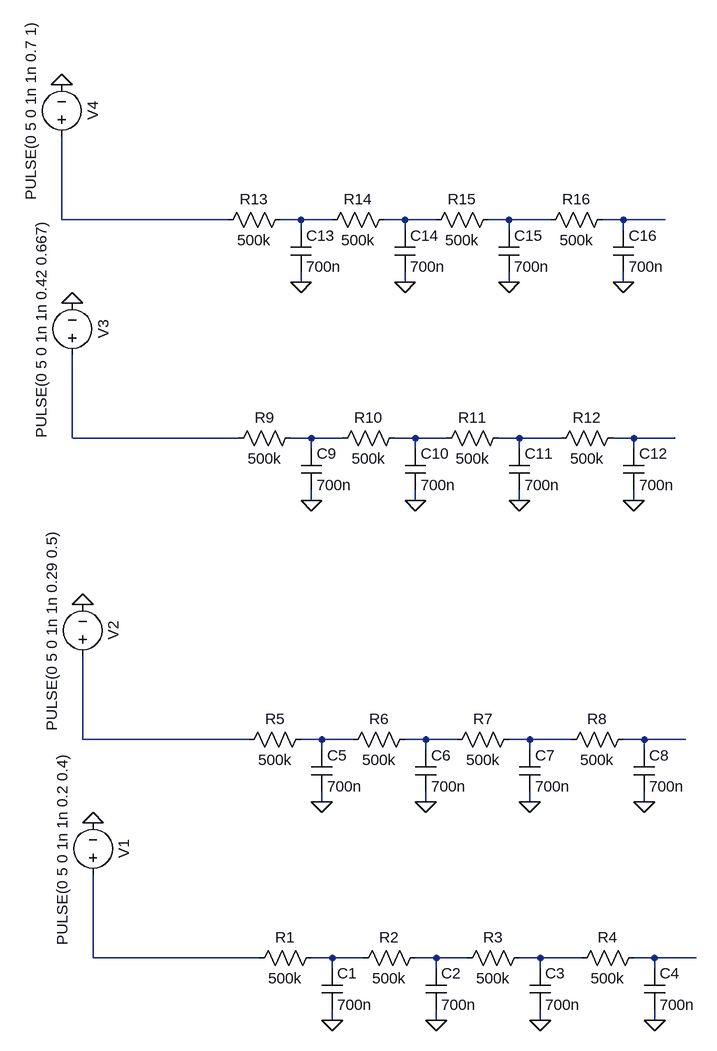
[diagram p0: schematic Draft3.asc]
Draft3.asc, the LTspice schematic file:
Version 4
SHEET 1 880 980
WIRE -416 -272 -416 -400
WIRE -160 -272 -416 -272
WIRE -48 -272 -80 -272
WIRE 0 -272 -48 -272
WIRE 112 -272 80 -272
WIRE 160 -272 112 -272
WIRE 272 -272 240 -272
WIRE 336 -272 272 -272
WIRE 448 -272 416 -272
WIRE 512 -272 448 -272
WIRE -48 -256 -48 -272
WIRE 112 -256 112 -272
WIRE 272 -256 272 -272
WIRE 448 -256 448 -272
WIRE -48 -176 -48 -192
WIRE 112 -176 112 -192
WIRE 272 -176 272 -192
WIRE 448 -176 448 -192
WIRE -400 64 -400 -64
WIRE -144 64 -400 64
WIRE -32 64 -64 64
WIRE 16 64 -32 64
WIRE 128 64 96 64
WIRE 176 64 128 64
WIRE 288 64 256 64
WIRE 352 64 288 64
WIRE 464 64 432 64
WIRE 528 64 464 64
WIRE -32 80 -32 64
WIRE 128 80 128 64
WIRE 288 80 288 64
WIRE 464 80 464 64
WIRE -32 160 -32 144
WIRE 128 160 128 144
WIRE 288 160 288 144
WIRE 464 160 464 144
WIRE -384 528 -384 400
WIRE -128 528 -384 528
WIRE -16 528 -48 528
WIRE 32 528 -16 528
WIRE 144 528 112 528
WIRE 192 528 144 528
WIRE 304 528 272 528
WIRE 368 528 304 528
WIRE 480 528 448 528
WIRE 544 528 480 528
WIRE -16 544 -16 528
WIRE 144 544 144 528
WIRE 304 544 304 528
WIRE 480 544 480 528
WIRE -16 624 -16 608
WIRE 144 624 144 608
WIRE 304 624 304 608
WIRE 480 624 480 608
WIRE -368 864 -368 736
WIRE -112 864 -368 864
WIRE 0 864 -32 864
WIRE 48 864 0 864
WIRE 160 864 128 864
WIRE 208 864 160 864
WIRE 320 864 288 864
WIRE 384 864 320 864
WIRE 496 864 464 864
WIRE 560 864 496 864
WIRE 0 880 0 864
WIRE 160 880 160 864
WIRE 320 880 320 864
WIRE 496 880 496 864
WIRE 0 960 0 944
WIRE 160 960 160 944
WIRE 320 960 320 944
WIRE 496 960 496 944
FLAG 0 960 0
FLAG 160 960 0
FLAG 320 960 0
FLAG -368 656 0
FLAG 496 960 0
FLAG -16 624 0
FLAG 144 624 0
FLAG 304 624 0
FLAG -384 320 0
FLAG 480 624 0
FLAG -32 160 0
FLAG 128 160 0
FLAG 288 160 0
FLAG -400 -144 0
FLAG 464 160 0
FLAG -48 -176 0
FLAG 112 -176 0
FLAG 272 -176 0
FLAG -416 -480 0
FLAG 448 -176 0
SYMBOL res -16 848 R90
WINDOW 0 0 56 VBottom 2
WINDOW 3 32 56 VTop 2
SYMATTR InstName R1
SYMATTR Value 500k
SYMBOL cap -16 880 R0
SYMATTR InstName C1
SYMATTR Value 700n
SYMBOL res 144 848 R90
WINDOW 0 0 56 VBottom 2
WINDOW 3 32 56 VTop 2
SYMATTR InstName R2
SYMATTR Value 500k
SYMBOL cap 144 880 R0
SYMATTR InstName C2
SYMATTR Value 700n
SYMBOL res 304 848 R90
WINDOW 0 0 56 VBottom 2
WINDOW 3 32 56 VTop 2
SYMATTR InstName R3
SYMATTR Value 500k
SYMBOL cap 304 880 R0
SYMATTR InstName C3
SYMATTR Value 700n
SYMBOL voltage -368 752 R180
WINDOW 0 -32 56 VBottom 2
WINDOW 3 32 56 VTop 2
WINDOW 123 0 0 Left 0
WINDOW 39 0 0 Left 0
SYMATTR InstName V1
SYMATTR Value PULSE(0 5 0 1n 1n 0.2 0.4)
SYMBOL res 480 848 R90
WINDOW 0 0 56 VBottom 2
WINDOW 3 32 56 VTop 2
SYMATTR InstName R4
SYMATTR Value 500k
SYMBOL cap 480 880 R0
SYMATTR InstName C4
SYMATTR Value 700n
SYMBOL res -32 512 R90
WINDOW 0 0 56 VBottom 2
WINDOW 3 32 56 VTop 2
SYMATTR InstName R5
SYMATTR Value 500k
SYMBOL cap -32 544 R0
SYMATTR InstName C5
SYMATTR Value 700n
SYMBOL res 128 512 R90
WINDOW 0 0 56 VBottom 2
WINDOW 3 32 56 VTop 2
SYMATTR InstName R6
SYMATTR Value 500k
SYMBOL cap 128 544 R0
SYMATTR InstName C6
SYMATTR Value 700n
SYMBOL res 288 512 R90
WINDOW 0 0 56 VBottom 2
WINDOW 3 32 56 VTop 2
SYMATTR InstName R7
SYMATTR Value 500k
SYMBOL cap 288 544 R0
SYMATTR InstName C7
SYMATTR Value 700n
SYMBOL voltage -384 416 R180
WINDOW 0 -32 56 VBottom 2
WINDOW 3 32 56 VTop 2
WINDOW 123 0 0 Left 0
WINDOW 39 0 0 Left 0
SYMATTR InstName V2
SYMATTR Value PULSE(0 5 0 1n 1n 0.29 0.5)
SYMBOL res 464 512 R90
WINDOW 0 0 56 VBottom 2
WINDOW 3 32 56 VTop 2
SYMATTR InstName R8
SYMATTR Value 500k
SYMBOL cap 464 544 R0
SYMATTR InstName C8
SYMATTR Value 700n
SYMBOL res -48 48 R90
WINDOW 0 0 56 VBottom 2
WINDOW 3 32 56 VTop 2
SYMATTR InstName R9
SYMATTR Value 500k
SYMBOL cap -48 80 R0
SYMATTR InstName C9
SYMATTR Value 700n
SYMBOL res 112 48 R90
WINDOW 0 0 56 VBottom 2
WINDOW 3 32 56 VTop 2
SYMATTR InstName R10
SYMATTR Value 500k
SYMBOL cap 112 80 R0
SYMATTR InstName C10
SYMATTR Value 700n
SYMBOL res 272 48 R90
WINDOW 0 0 56 VBottom 2
WINDOW 3 32 56 VTop 2
SYMATTR InstName R11
SYMATTR Value 500k
SYMBOL cap 272 80 R0
SYMATTR InstName C11
SYMATTR Value 700n
SYMBOL voltage -400 -48 R180
WINDOW 0 -32 56 VBottom 2
WINDOW 3 32 56 VTop 2
WINDOW 123 0 0 Left 0
WINDOW 39 0 0 Left 0
SYMATTR InstName V3
SYMATTR Value PULSE(0 5 0 1n 1n 0.42 0.667)
SYMBOL res 448 48 R90
WINDOW 0 0 56 VBottom 2
WINDOW 3 32 56 VTop 2
SYMATTR InstName R12
SYMATTR Value 500k
SYMBOL cap 448 80 R0
SYMATTR InstName C12
SYMATTR Value 700n
SYMBOL res -64 -288 R90
WINDOW 0 0 56 VBottom 2
WINDOW 3 32 56 VTop 2
SYMATTR InstName R13
SYMATTR Value 500k
SYMBOL cap -64 -256 R0
SYMATTR InstName C13
SYMATTR Value 700n
SYMBOL res 96 -288 R90
WINDOW 0 0 56 VBottom 2
WINDOW 3 32 56 VTop 2
SYMATTR InstName R14
SYMATTR Value 500k
SYMBOL cap 96 -256 R0
SYMATTR InstName C14
SYMATTR Value 700n
SYMBOL res 256 -288 R90
WINDOW 0 0 56 VBottom 2
WINDOW 3 32 56 VTop 2
SYMATTR InstName R15
SYMATTR Value 500k
SYMBOL cap 256 -256 R0
SYMATTR InstName C15
SYMATTR Value 700n
SYMBOL voltage -416 -384 R180
WINDOW 0 -32 56 VBottom 2
WINDOW 3 32 56 VTop 2
WINDOW 123 0 0 Left 0
WINDOW 39 0 0 Left 0
SYMATTR InstName V4
SYMATTR Value PULSE(0 5 0 1n 1n 0.7 1)
SYMBOL res 432 -288 R90
WINDOW 0 0 56 VBottom 2
WINDOW 3 32 56 VTop 2
SYMATTR InstName R16
SYMATTR Value 500k
SYMBOL cap 432 -256 R0
SYMATTR InstName C16
SYMATTR Value 700n

The netlist it stands for:
* Draft3.asc
R1 N017 N016 500k
C1 N017 0 700n
R2 N018 N017 500k
C2 N018 0 700n
R3 N019 N018 500k
C3 N019 0 700n
V1 N016 0 PULSE(0 5 0 1n 1n 0.2 0.4)
R4 N020 N019 500k
C4 N020 0 700n
R5 N012 N011 500k
C5 N012 0 700n
R6 N013 N012 500k
C6 N013 0 700n
R7 N014 N013 500k
C7 N014 0 700n
V2 N011 0 PULSE(0 5 0 1n 1n 0.29 0.5)
R8 N015 N014 500k
C8 N015 0 700n
R9 N007 N006 500k
C9 N007 0 700n
R10 N008 N007 500k
C10 N008 0 700n
R11 N009 N008 500k
C11 N009 0 700n
V3 N006 0 PULSE(0 5 0 1n 1n 0.42 0.667)
R12 N010 N009 500k
C12 N010 0 700n
R13 N002 N001 500k
C13 N002 0 700n
R14 N003 N002 500k
C14 N003 0 700n
R15 N004 N003 500k
C15 N004 0 700n
V4 N001 0 PULSE(0 5 0 1n 1n 0.7 1)
R16 N005 N004 500k
C16 N005 0 700n
.backanno
.end